# Altium project ST-Link.PrjPcb
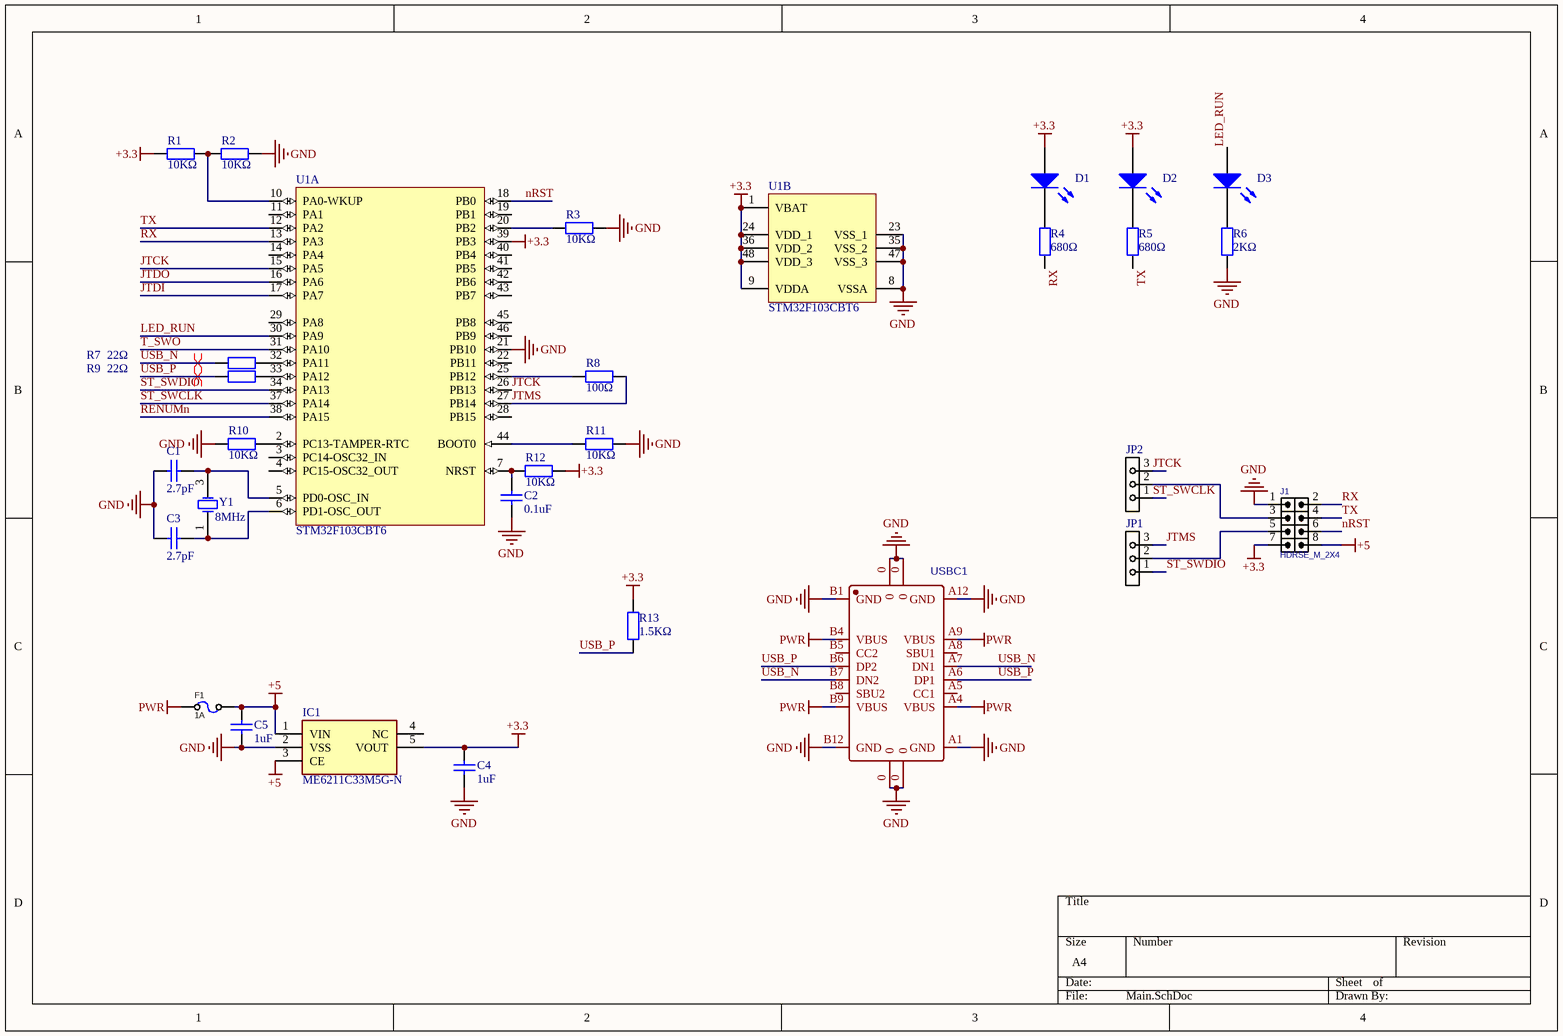
[diagram p0: Main.SchDoc]
1 sheet, 29 parts. Net scope: global (net labels, ports and power ports of the same name join across sheets).
Board file: PCB1.PcbDoc

## Sheet Main.SchDoc
size A4; SheetNumber: 1; SheetTotal: 1

### Parts
C1  2.7pF  [0603_C]
C2  0.1uF  [0603_C]
C3  2.7pF  [0603_C]
C4  1uF  [0603_C]
C5  1uF  [0603_C]
D1  (no value)  [0603_LED_S1]
D2  (no value)  [0603_LED_S1]
D3  (no value)  [0603_LED_S1]
F1  1A  [F0805]
IC1  ME6211C33M5G-N  [SOT95P270X145-5N]
J1  HDRSE_M_2X4  [HDRSE_M_2X4]
JP1  JUMPER_SOLDER_3P  [JP_3_60W]  (value not drawn)
JP2  JUMPER_SOLDER_3P  [JP_3_60W]  (value not drawn)
R1  10KΩ  [0603_R]
R2  10KΩ  [0603_R]
R3  10KΩ  [0603_R]
R4  680Ω  [0603_R]
R5  680Ω  [0603_R]
R6  2KΩ  [0603_R]
R7  22Ω  [0603_R]
R8  100Ω  [0603_R]
R9  22Ω  [0603_R]
R10  10KΩ  [0603_R]
R11  10KΩ  [0603_R]
R12  10KΩ  [0603_R]
R13  1.5KΩ  [0603_R]
U1  STM32F103CBT6  [STM-LQFP48_N]  (parts A,B of 2)
USBC1  USB2.0 Type-C 16Pin母座  [USB-C-SMD_TYPE-C-USB-5]  (value not drawn)
Y1  8MHz  [SMD-3225_4P]

### Nets
+3.3: C4.2 D1.A D2.A IC1.5(VOUT) J1.7 R1.1 R12.2 R13.2 U1.1(VBAT) U1.9(VDDA) U1.24(VDD_1) U1.36(VDD_2) U1.39(PB3) U1.48(VDD_3)
+5: C5.2 F1.2 IC1.1(VIN) IC1.3(CE) J1.8
GND: C1.1 C2.1 C3.1 C4.1 C5.1 IC1.2(VSS) J1.1 R2.2 R3.2 R6.1 R10.1 R11.2 U1.8(VSSA) U1.21(PB10) U1.23(VSS_1) U1.35(VSS_2) U1.47(VSS_3) USBC1.0 USBC1.A1(GND) USBC1.A12(GND) USBC1.B1(GND) USBC1.B12(GND)
PWR: F1.1 USBC1.A4(VBUS) USBC1.A9(VBUS) USBC1.B4(VBUS) USBC1.B9(VBUS)
JTCK: JP2.3 U1.15(PA5) U1.26(PB13)
JTDI: U1.17(PA7)
JTDO: U1.16(PA6)
JTMS: JP1.3 R8.2 U1.27(PB14)
LED_RUN: D3.A U1.30(PA9)
nRST: J1.6 U1.18(PB0)
RENUMn: U1.38(PA15)
RX: J1.2 R4.1 U1.13(PA3)
ST_SWCLK: JP2.1 U1.37(PA14)
ST_SWDIO: JP1.1 U1.34(PA13)
T_SWO: U1.31(PA10)
TX: J1.4 R5.1 U1.12(PA2)
USB_N: R7.1 USBC1.A7(DN1) USBC1.B7(DN2)
USB_P: R9.1 R13.1 USBC1.A6(DP1) USBC1.B6(DP2)
NetC1_2: C1.2 U1.5(PD0-OSC_IN) Y1.3(OSC2)
NetC2_2: C2.2 R12.1 U1.7(NRST)
NetC3_2: C3.2 U1.6(PD1-OSC_OUT) Y1.1(OSC1)
NetD1_K: D1.K R4.2
NetD2_K: D2.K R5.2
NetD3_K: D3.K R6.2
NetJ1_3: J1.3 JP2.2
NetJ1_5: J1.5 JP1.2
NetR1_2: R1.2 R2.1 U1.10(PA0-WKUP)
NetR3_1: R3.1 U1.20(PB2)
NetR7_2: R7.2 U1.32(PA11)
NetR8_1: R8.1 U1.25(PB12)
NetR9_2: R9.2 U1.33(PA12)
NetR10_2: R10.2 U1.2(PC13-TAMPER-RTC)
NetR11_1: R11.1 U1.44(BOOT0)

Not connected (* = marked no-connect by the designer): IC1 4(NC); U1 3(PC14-OSC32_IN) 4(PC15-OSC32_OUT) 11(PA1) 14(PA4) 19(PB1) 22(PB11) 28(PB15) 29(PA8) 40(PB4) 41(PB5) 42(PB6) 43(PB7) 45(PB8) 46(PB9); USBC1 A5(CC1) A8(SBU1) B5(CC2) B8(SBU2)

### Layout directives
differential pair: USB_N, USB_P

### Library data of the parts
C1 C3 = CMP-002-000144-1: 贴片电容; Package: 0603; ComponentLink1URL: http://www.szlcsc.com/product/details_16831.html; ComponentLink1Description: 供应商链接; Design Item ID: 0603 2.7pF (2R7) 0.25pF 50V; Source: Cap.SchLib; SuppliersPartNumber: C16149
C2 C4 C5 = CMP-002-000018-1: 贴片电容; Design Item ID: 0603 1uF (105) 10% 50V; Package: 0603; SuppliersPartNumber: C15849; Source: Cap.SchLib; ComponentLink1Description: 供应商链接; ComponentLink1URL: http://www.szlcsc.com/product/details_16531.html
D1-D3 = CMP-012-000003-2: 发光二极管; Design Item ID: 0603 蓝灯; ComponentLink1URL: http://www.szlcsc.com/product/details_73150.html; Package: 0603; SuppliersPartNumber: C72041; Source: LED.SchLib; ComponentLink1Description: 供应商链接
F1 = CMP-001-000024-1: VALUE: FUSE500mA; PARAM2: 0.25 Ohm DC Cold Resistance; PARAM: 500mA; 32VDC; fast acting; MANF_P#: MANF_PART#; MANF: MANF; Source: protect_tvs_esd_fuse.SchLib; Design Item ID: FUSE_500mA_0805_FAST
IC1 = CMP-001-0849-1: Integrated Circuit; Manufacturer_Name: Microne; Source: SamacSys.SchLib; Design Item ID: ME6211C33M5G-N; Height: 1.45mm; Datasheet Link: https://datasheet.lcsc.com/szlcsc/1811131510_MICRONE-Nanjing-Micro-One-Elec-ME6211C33M5G-N_C82942.pdf; Manufacturer_Part_Number: ME6211C33M5G-N
J1 = CMP-002-00326-1: CONN, HEADER, Male, pitch: 2.54mm, 8POS; MANF_P#: MANF_PART#; VALUE: HDRM_2X4; Source: conn_header_2.54_st_smd_edge.SchLib; MANF: MANF; Design Item ID: HDRSE_M_2X4
JP1 JP2 = CMP-001-0854-1: JUMPER, HEADER 3PIN; VALUE: JMPHDR3PIN; Design Item ID: JUMPER_SOLDER_3P; MANF: MANF; MANF_P#: MANF_P#; Source: test-tp_jumper.SchLib
R1-R13 = CMP-004-000401-1: 贴片电阻; Package: 0603; SuppliersPartNumber: C25804; ComponentLink1URL: http://www.szlcsc.com/product/details_26547.html; Source: RES.SchLib; ComponentLink1Description: 供应商链接; Design Item ID: 0603 10KΩ (1002) 1%
U1 = CMP-001-0295-1: ARM Cortex-M3 32-bit MCU, 128 KB Flash, 20 KB Internal RAM, 37 I/Os, 48-pin LQFP, -40 to 85 degC, Tray; A/D Converter: 2x12-bit (10 Channel); Internal RAM Size (kB): 20; Operating Frequency(F) (Processor speed) (MHz): 72Hz; I/Os (High Current): 37; Supply Voltage(Vcc) min (V): 2; FLASH Size (Prog) (kB): 128; Core: ARM Cortex-M3; DatasheetVersion: Rev. 16; PackageReference: LQFP48; PackageDescription: 48-Pin Low Profile Quad Flat Package, 7 x 7 mm Body, 0.5 mm Pitch; Pin Count: 48; PartNumber: STM32F103CBT6; ComponentLink2URL: http://www.st.com/st-web-ui/static/active/en/resource/technical/document/datasheet/CD00161566.pdf; Design Item ID: STM32F103CBT6; Source: STMicroelectronics STM32 F1.SchLib; Packing: Tray; Mounting Technology: Surface Mount; ComponentLink2Description: Datasheet; PackageVersion: Rev. 6, 06/2013; ComponentLink1Description: Manufacturer URL; ComponentLink1URL: http://www.st.com/web/en/home.html; ComponentLink3URL: http://www.st.com/st-web-ui/static/active/en/resource/technical/document/datasheet/DM00058181.pdf; ComponentLink3Description: Package Specification; Component Type: Standard
USBC1 = CMP-00155-3: USB2.0 Type-C 母座 16Pin; Author: 白一清; Part Number: USB2.0 Type-C 16Pin母座
Y1 = CMP-016-000002-1: 贴片晶振; Package: SMD-3225_4P; SuppliersPartNumber: C9002; ComponentLink1Description: 供应商链接; Design Item ID: SMD-3225_4P  12MHZ 20PF 10PPM; ComponentLink1URL: http://www.szlcsc.com/product/details_9522.html; Source: CrystalOscillator.SchLib